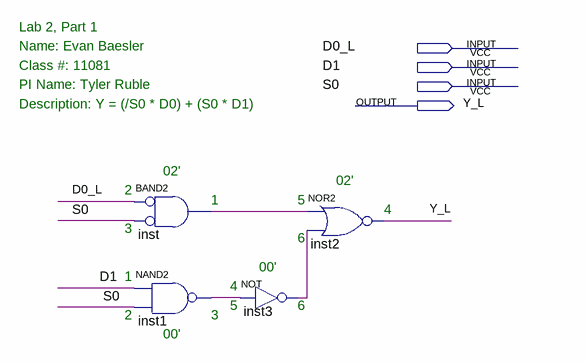
[diagram p0: schematic sheet]
// Quartus schematic lab2_2inMUX.bdf as structural Verilog: 4 symbols, 4 pins
module lab2_2inMUX (
  input  D0_L,
  input  D1,
  input  S0,
  output Y_L
);

  wire inst1_out, inst3_out, inst_out;

  and inst (inst_out, ~D0_L, ~S0);  // BAND2
  nand inst1 (inst1_out, D1, S0);
  not inst3 (inst3_out, inst1_out);
  nor inst2 (Y_L, inst_out, inst3_out);

  // Notes on the sheet:
  //   Lab 2, Part 1
  //   Name: Evan Baesler
  //   Class #: 11081
  //   PI Name: Tyler Ruble
  //   Description: Y = (/S0 * D0) + (S0 * D1)
  //   02'
  //   02'
  //   2
  //   1
  //   5
  //   4
  //   3
  //   6
  //   00'
  //   1
  //   4
  //   5
  //   6
  //   2
  //   3
  //   00'
endmodule
